# Altium schematic sheet ESenseFE-Dual-TwinT-60HzNotchFilter-AdjQ.SchDoc
size C
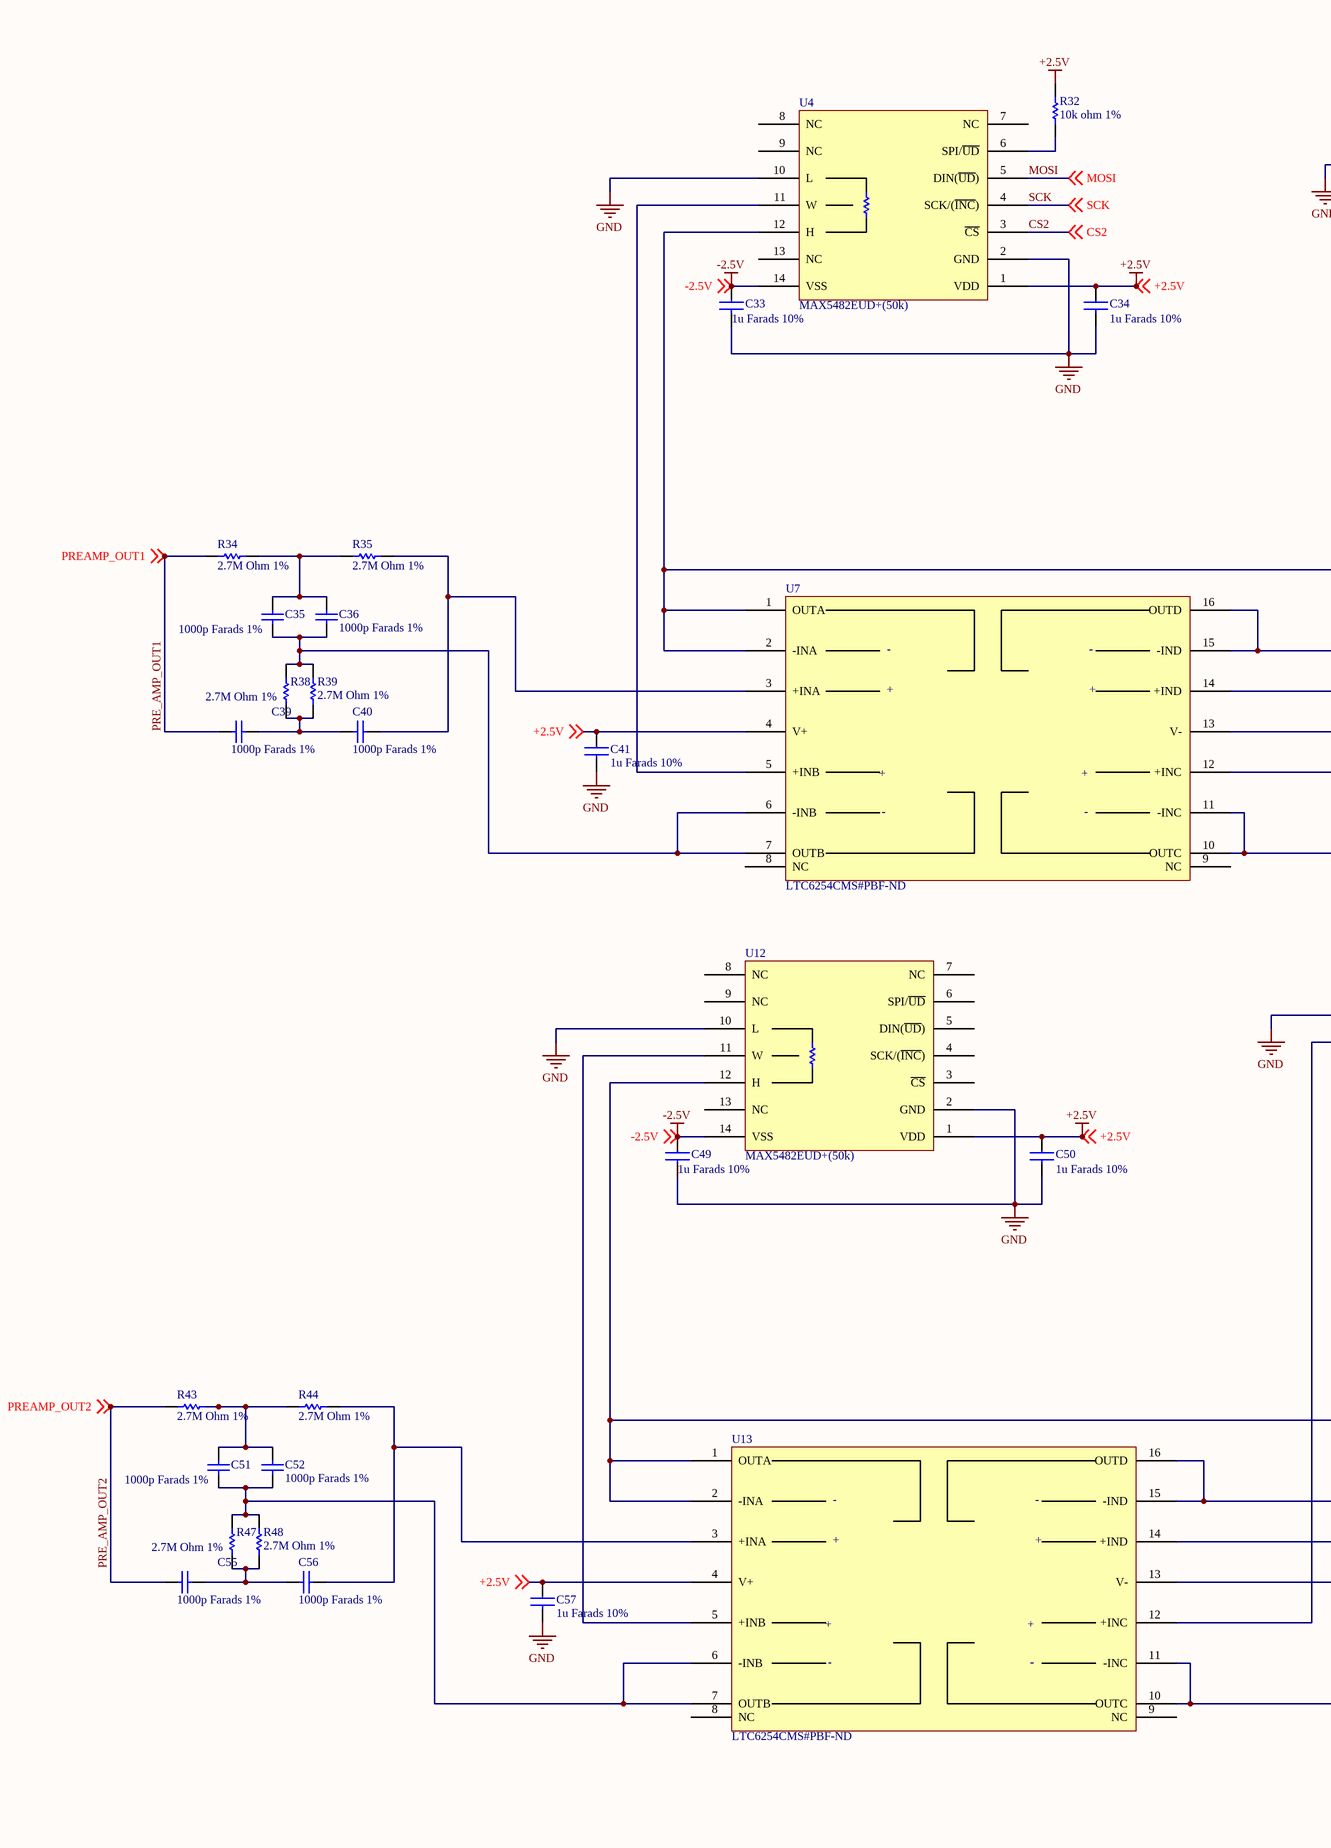
[diagram p0: ESenseFE-Dual-TwinT-60HzNotchFilter-AdjQ.SchDoc, left]
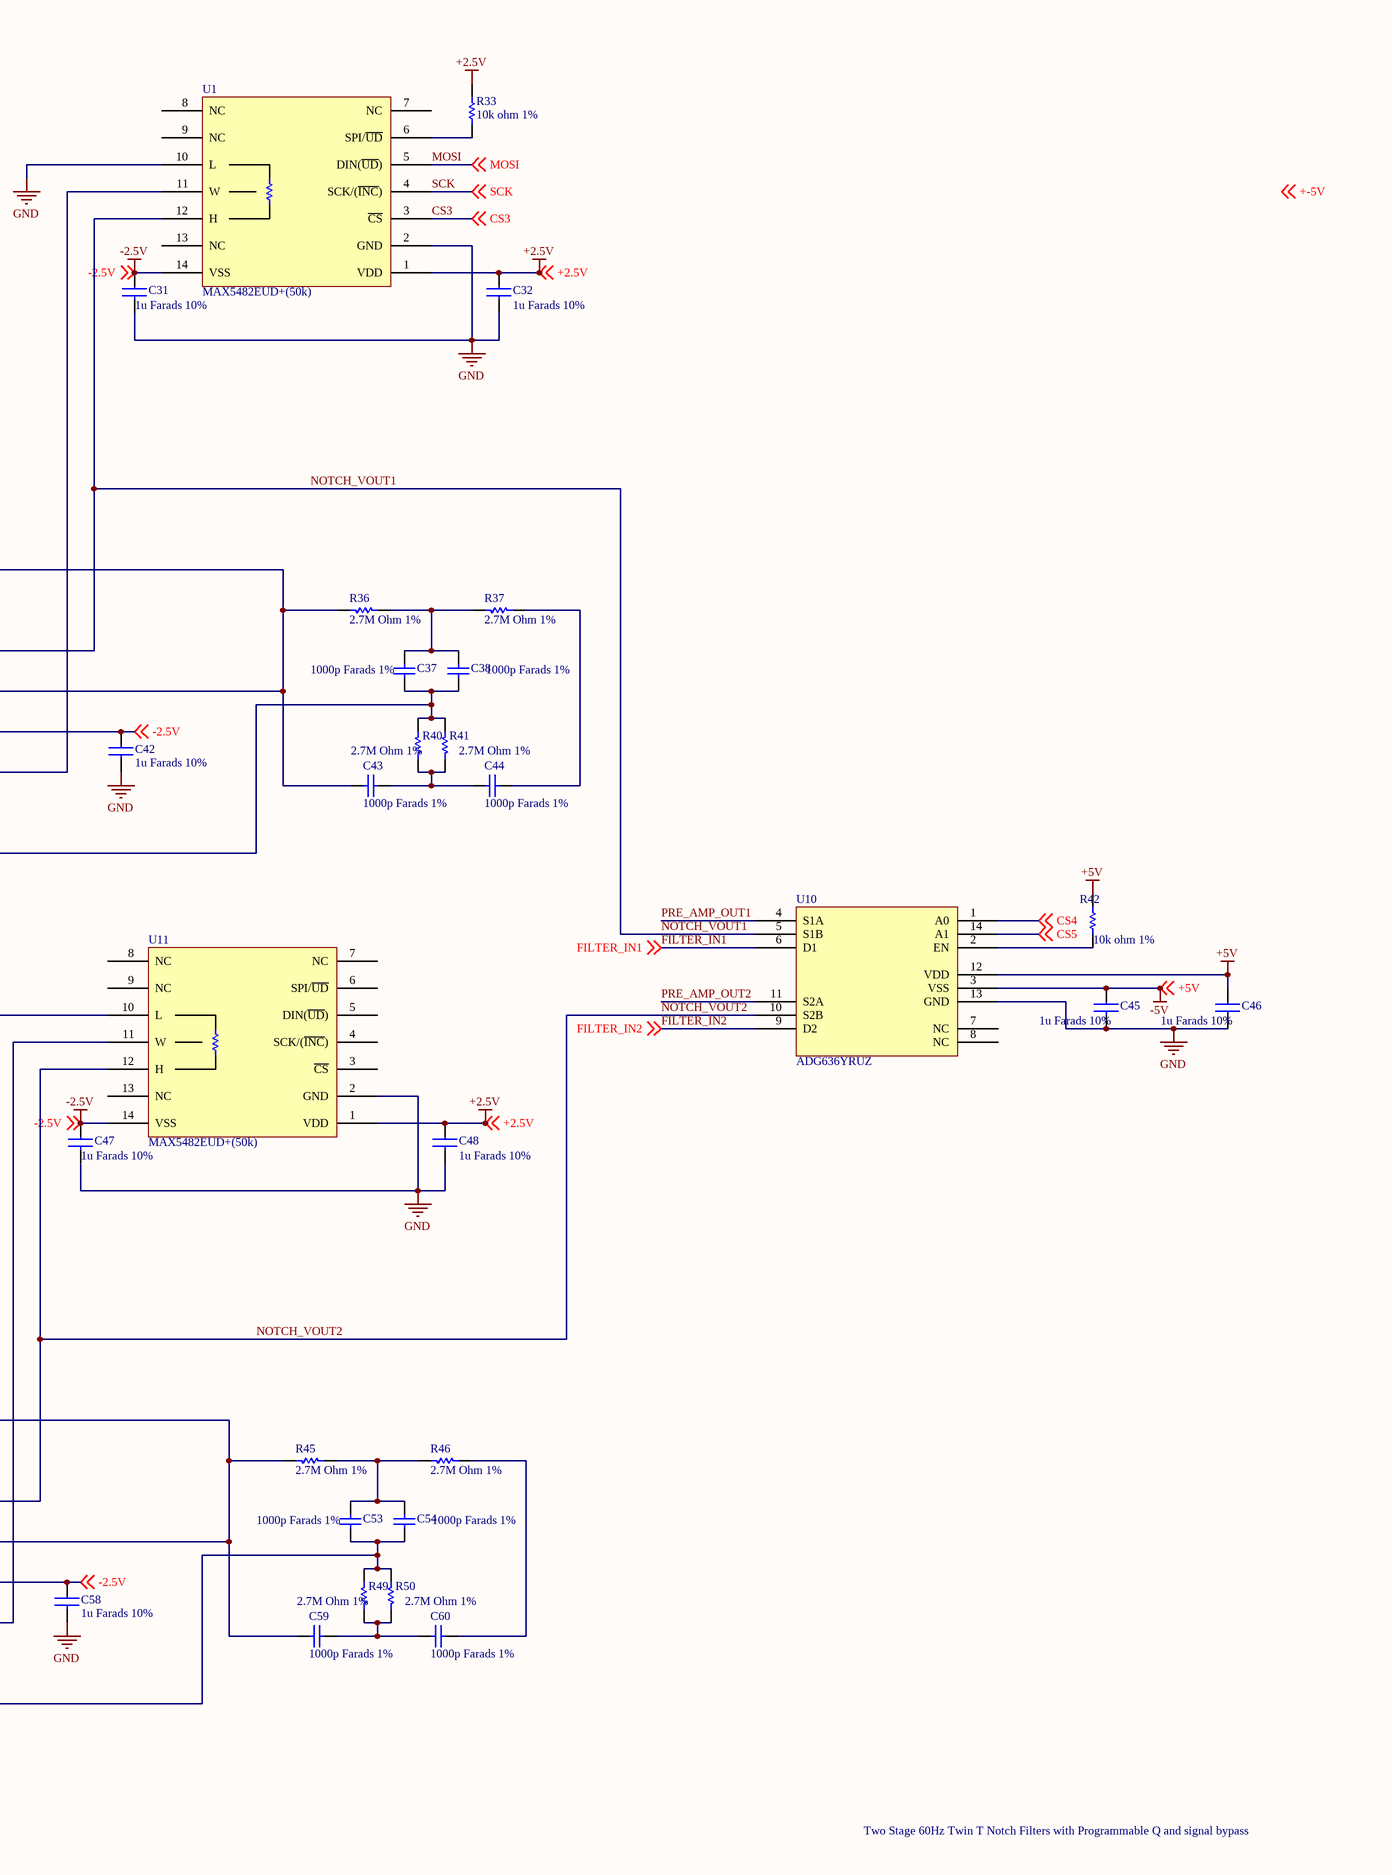
[diagram p1: ESenseFE-Dual-TwinT-60HzNotchFilter-AdjQ.SchDoc, right]

## Parts
C31  1u Farads 10%  [SM/C_0603]
C32  1u Farads 10%  [SM/C_0603]
C33  1u Farads 10%  [SM/C_0603]
C34  1u Farads 10%  [SM/C_0603]
C35  1000p Farads 1%  [SM/C_0603]
C36  1000p Farads 1%  [SM/C_0603]
C37  1000p Farads 1%  [SM/C_0603]
C38  1000p Farads 1%  [SM/C_0603]
C39  1000p Farads 1%  [SM/C_0603]
C40  1000p Farads 1%  [SM/C_0603]
C41  1u Farads 10%  [SM/C_0603]
C42  1u Farads 10%  [SM/C_0603]
C43  1000p Farads 1%  [SM/C_0603]
C44  1000p Farads 1%  [SM/C_0603]
C45  1u Farads 10%  [SM/C_0603]
C46  1u Farads 10%  [SM/C_0603]
C47  1u Farads 10%  [SM/C_0603]
C48  1u Farads 10%  [SM/C_0603]
C49  1u Farads 10%  [SM/C_0603]
C50  1u Farads 10%  [SM/C_0603]
C51  1000p Farads 1%  [SM/C_0603]
C52  1000p Farads 1%  [SM/C_0603]
C53  1000p Farads 1%  [SM/C_0603]
C54  1000p Farads 1%  [SM/C_0603]
C55  1000p Farads 1%  [SM/C_0603]
C56  1000p Farads 1%  [SM/C_0603]
C57  1u Farads 10%  [SM/C_0603]
C58  1u Farads 10%  [SM/C_0603]
C59  1000p Farads 1%  [SM/C_0603]
C60  1000p Farads 1%  [SM/C_0603]
R32  10k ohm 1%  [SM/C_0603]
R33  10k ohm 1%  [SM/C_0603]
R34  2.7M Ohm 1%  [SM/R_0603]
R35  2.7M Ohm 1%  [SM/R_0603]
R36  2.7M Ohm 1%  [SM/R_0603]
R37  2.7M Ohm 1%  [SM/R_0603]
R38  2.7M Ohm 1%  [SM/R_0603]
R39  2.7M Ohm 1%  [SM/R_0603]
R40  2.7M Ohm 1%  [SM/R_0603]
R41  2.7M Ohm 1%  [SM/R_0603]
R42  10k ohm 1%  [SM/C_0603]
R43  2.7M Ohm 1%  [SM/R_0603]
R44  2.7M Ohm 1%  [SM/R_0603]
R45  2.7M Ohm 1%  [SM/R_0603]
R46  2.7M Ohm 1%  [SM/R_0603]
R47  2.7M Ohm 1%  [SM/R_0603]
R48  2.7M Ohm 1%  [SM/R_0603]
R49  2.7M Ohm 1%  [SM/R_0603]
R50  2.7M Ohm 1%  [SM/R_0603]
U1  MAX5482EUD+(50k)  [TSSOP-16Lead-MAX548X]
U4  MAX5482EUD+(50k)  [TSSOP-16Lead-MAX548X]
U7  LTC6254CMS#PBF-ND  [MSOP-16Lead-LTC6254]
U10  ADG636YRUZ  [TSSOP-14Lead-AnalogDevices-ADG636]
U11  MAX5482EUD+(50k)  [TSSOP-16Lead-MAX548X]
U12  MAX5482EUD+(50k)  [TSSOP-16Lead-MAX548X]
U13  LTC6254CMS#PBF-ND  [MSOP-16Lead-LTC6254]

## Nets
+2.5V: C32.1 C34.1 C41.1 C48.1 C50.1 C57.1 R32.2 R33.2 U1.1(VDD) U4.1(VDD) U7.4(V+) U11.1(VDD) U12.1(VDD) U13.4(V+) ; off-sheet +2.5V
+5V: C45.1 C46.1 R42.1 U10.3(VSS) U10.12(VDD) ; off-sheet +5V  [also labelled -5V]
-2.5V: C31.1 C33.1 C42.1 C47.1 C49.1 C58.1 U1.14(VSS) U4.14(VSS) U7.13(V-) U11.14(VSS) U12.14(VSS) U13.13(V-) ; off-sheet -2.5V
GND: C31.2 C32.2 C33.2 C34.2 C41.2 C42.2 C45.2 C46.2 C47.2 C48.2 C49.2 C50.2 C57.2 C58.2 U1.2(GND) U1.10(L) U4.2(GND) U4.10(L) U10.13(GND) U11.2(GND) U11.10(L) U12.2(GND) U12.10(L)
CS2: U4.3(~{CS}) ; off-sheet CS2
CS3: U1.3(~{CS}) ; off-sheet CS3
CS4: U10.1(A0) ; off-sheet CS4
CS5: U10.14(A1) ; off-sheet CS5
FILTER_IN1: U10.6(D1) ; off-sheet FILTER_IN1
FILTER_IN2: U10.9(D2) ; off-sheet FILTER_IN2
MOSI: U1.5(DIN(~{UD})) U4.5(DIN(~{UD})) ; off-sheet MOSI
NOTCH_VOUT1: U1.12(H) U7.15(-IND) U7.16(OUTD) U10.5(S1B)
NOTCH_VOUT2: U10.10(S2B) U11.12(H) U13.15(-IND) U13.16(OUTD)
PRE_AMP_OUT1: C39.2 R34.1 U10.4(S1A) ; off-sheet PREAMP_OUT1  [also labelled PREAMP_OUT1]
PRE_AMP_OUT2: C55.2 R43.1 U10.11(S2A) ; off-sheet PREAMP_OUT2  [also labelled PREAMP_OUT2]
SCK: U1.4(SCK/(~{INC})) U4.4(SCK/(~{INC})) ; off-sheet SCK
NetC35_1: C35.1 C36.1 R38.1 R39.1 U7.6(-INB) U7.7(OUTB)
NetC35_2: C35.2 C36.2 R34.2 R35.1
NetC37_1: C37.1 C38.1 R40.1 R41.1 U7.10(OUTC) U7.11(-INC)
NetC37_2: C37.2 C38.2 R36.1 R37.2
NetC39_1: C39.1 C40.2 R38.2 R39.2
NetC40_1: C40.1 R35.2 U7.3(+INA)
NetC43_1: C43.1 R36.2 U4.12(H) U7.1(OUTA) U7.2(-INA) U7.14(+IND)
NetC43_2: C43.2 C44.1 R40.2 R41.2
NetC44_2: C44.2 R37.1
NetC51_1: C51.1 C52.1 R47.1 R48.1 U13.6(-INB) U13.7(OUTB)
NetC51_2: C51.2 C52.2 R43.2 R44.1
NetC53_1: C53.1 C54.1 R49.1 R50.1 U13.10(OUTC) U13.11(-INC)
NetC53_2: C53.2 C54.2 R45.1 R46.2
NetC55_1: C55.1 C56.2 R47.2 R48.2
NetC56_1: C56.1 R44.2 U13.3(+INA)
NetC59_1: C59.1 R45.2 U12.12(H) U13.1(OUTA) U13.2(-INA) U13.14(+IND)
NetC59_2: C59.2 C60.1 R49.2 R50.2
NetC60_2: C60.2 R46.1
NetR32_1: R32.1 U4.6(SPI/~{UD})
NetR33_1: R33.1 U1.6(SPI/~{UD})
NetR42_2: R42.2 U10.2(EN)
NetU1_11: U1.11(W) U7.12(+INC)
NetU4_11: U4.11(W) U7.5(+INB)
NetU11_11: U11.11(W) U13.12(+INC)
NetU12_11: U12.11(W) U13.5(+INB)

Not connected (* = marked no-connect by the designer): U1 7(NC) 8(NC) 9(NC) 13(NC); U4 7(NC) 8(NC) 9(NC) 13(NC); U7 8(NC) 9(NC); U10 7(NC) 8(NC); U11 3(~{CS}) 4(SCK/(~{INC})) 5(DIN(~{UD})) 6(SPI/~{UD}) 7(NC) 8(NC) 9(NC) 13(NC); U12 3(~{CS}) 4(SCK/(~{INC})) 5(DIN(~{UD})) 6(SPI/~{UD}) 7(NC) 8(NC) 9(NC) 13(NC); U13 8(NC) 9(NC)

## Notes on the sheet
- Two Stage 60Hz Twin T Notch Filters with Programmable Q and signal bypass
- Labels drawn without touching a wire or pin: +-5V
- (in symbol 2191) -; +

## Library data of the parts
C31-C34 C41 C42 C45-C50 C57 C58 = 2065: CAP CER 1.0UF 10V 10% X5R 0603; mfrName: Murata Electronics North America; mfrPartNum: GRM188R61A105KA61D; Extra_Description: Datasheets	Chip Monolithic Ceramic Caps Part Numbering / GRM Series Spec/Test Methods (1) / GRM188R61A105KA61 / Product Photos	0603 Murata MLCC Caps / Product Training Modules	High-Cap Multilayer Ceramic Capacitors / Catalog Drawings	GRM Series Top, Sides / Standard Package	10 / Category	Capacitors / Family	Ceramic / Series	GRM / Capacitance	1.0µF / Voltage - Rated	10V / Tolerance	±10% / Temperature Coefficient	X5R / Mounting Type	Surface Mount, MLCC / Operating Temperature	-55°C ~ 85°C / Features	- / Applications	General Purpose / Ratings	- / Package / Case	0603 (1608 Metric) / Size / Dimension	0.063`` L x 0.032`` W (1.60mm x 0.80mm) / Lead Spacing	- / Thickness	0.80mm / Packaging	Cut Tape (CT) / Lead Style	- / Catalog Page	1886 (US2010 Interactive) / 1886 (US2010 PDF) / Other Names	490-1543-1; Obsolete: False; Temp_Max: 0; Type: Ceramic; PartID: 2065; URL_Image: HTTP://MEDIA.DIGIKEY.COM/PHOTOS/MURATA%20PHOTOS/0603%20MURATA%20MLCC%20CAPS.JPG; URL_Datasheet: http://search.murata.co.jp/Ceramy/image/img/w_hinm/L0005E.pdf; Date_Created: 9/27/2010 4:47:48 PM; Date_LastModified: 9/27/2010 4:47:48 PM; Verified: False; RoHS: True; Temp_Min: 0
C35-C40 C43 C44 C51-C56 C59 C60 = 2205: capacitor ceramic 1000pf, 50v, c0g, 0603; dielectric; mfrName: AVX; mfrPartNum: 06035A102FAT2A; Label: 1uF; Extra_Description: CAPACITOR CERAMIC 1000PF, 50V, C0G, 0603; Dielectric Characteristic:C0G/NP0; Capacitance:1000pF; Capacitance Tolerance:± 1%; Voltage Rating:50V; Temperature Coefficient:0 ± 30ppm/°C; Capacitor Case Style:0603; No. of Pins:2 ;RoHS Compliant: Yes / Packaging: ``Tape`` / RoHS: ``Compliant`` / Voltage Rating (DC): { / ``uncertainty_minus``: null, / ``value``: 50.0, / ``uncertainty_plus``: null / } / Capacitance: { / ``uncertainty_minus``: null, / ``value``: 1E-09, / ``uncertainty_plus``: null / } / Capacitance Tolerance: { / ``max_value``: 1.0, / ``max_uncertainty_plus``: null, / ``min_value``: -1.0, / ``min_uncertainty_plus``: null, / ``max_uncertainty_minus``: null / } / Number of Pins: 2; Obsolete: False; Temp_Max: 0; Type: All Parts; TypeNotes: Applies to all parts in the database; PartID: 2205; URL_Image: http://cdn.sigma.octopart.com/8893021/image/AVX-06035A102FAT2A.jpg; URL_Datasheet: http://datasheet.octopart.com/06035A102FAT2A-AVX-datasheet-8446347.pdf; Date_Created: 5/8/2011 9:06:39 AM; Date_LastModified: 5/8/2011 9:06:39 AM; Verified: False; RoHS: True; Temp_Min: 0
R32 R33 R42 = 2165: resistor, 0603, 0.1w, 1%, 10k; resistance:10kohm; resistance; mfrName: Panasonic; mfrPartNum: ERJ-3EKF1002V; Value: 1K; Extra_Description: RESISTOR, 0603, 0.1W, 1%, 10K; Resistance:10kohm; Resistance Tolerance:± 1%; Power Rating:0.1W; Voltage Rating:75V; Series:ERJ; Temperature Coefficient:± 200ppm/°C; Resistor Element Type:Thick Film; Resistor Case Style:0603; No. of Pins:2; Case Style:0603; External Length / Height:0.45mm; External Depth:0.8mm; External Width:1.6mm; Operating Temperature Range:-55°C to +155°C; Overload Voltage:150V; Reel Quantity:5000; Termination Type:SMD / Mounting Type: ``Surface Mount`` / Case / Package: ``0603`` / Packaging: ``Cut Tape (CT)`` / Lead-Free Status: ``Contains Lead`` / RoHS: ``Compliant`` / Resistance: { / ``uncertainty_minus``: null, / ``value``: 10000.0, / ``uncertainty_plus``: null / } / Voltage Rating (DC): { / ``uncertainty_minus``: null, / ``value``: 75.0, / ``uncertainty_plus``: null / } / Size-Width: { / ``uncertainty_minus``: null, / ``value``: 0.0008, / ``uncertainty_plus``: null / } / Size-Length: { / ``uncertainty_minus``: null, / ``value``: 0.0016, / ``uncertainty_plus``: null / } / Size-Height: { / ``uncertainty_minus``: null, / ``value``: 0.00045, / ``uncertainty_plus``: null / } / Power Rating: { / ``uncertainty_minus``: null, / ``value``: 0.1, / ``uncertainty_plus``: null / } / Resistance Tolerance: { / ``max_value``: 1.0, / ``max_uncertainty_plus``: null, / ``min_value``: -1.0, / ``min_uncertainty_plus``: null, / ``max_uncertainty_minus``: null / } / Operating Temperature: { / ``max_value``: 125.0, / ``max_uncertainty_plus``: null, / ``min_value``: null, / ``min_uncertainty_plus``: null, / ``max_uncertainty_minus``: null / } / Number of Pins: 2; Obsolete: False; Temp_Max: 0; TypeNotes: Applies to all parts in the database; Published: 8-Jun-2000; LatestRevisionDate: 17-Jul-2002; LatestRevisionNote: Re-released for DXP Platform.; PackageReference: AXIAL-0.3; Publisher: Altium Limited; PartID: 2165; URL_Image: http://cdn.sigma.octopart.com/8893006/image/Panasonic-ERJ-3EKF1002V.jpg; URL_Datasheet: http://datasheet.octopart.com/ERJ-3EKF1002V-Panasonic-datasheet-118621.pdf; Date_Created: 4/24/2011 7:23:38 AM; Date_LastModified: 4/24/2011 7:23:38 AM; Verified: False; RoHS: True; Temp_Min: 0; Type: All Parts
R34-R41 R43-R50 = 2206: res, thick film, 2.7mohm, 100mw, 1%; resistance:2.7mohm;; mfrName: Vishay; mfrPartNum: CRCW06032M70FKEA; Value: 1K; Extra_Description: RES, THICK FILM, 2.7MOHM, 100mW, 1%; Resistance:2.7Mohm; Resistance Tolerance:± 1%; Power Rating:100mW; Series:CRCW; Temperature Coefficient:± 100ppm; Resistor Element Material:Thick Film; Resistor Case Style:0603; No. of Pins:2 ;RoHS Compliant: Yes / Mounting Type: ``Surface Mount`` / Case / Package: ``0603`` / Packaging: ``Cut Tape (CT)`` / Lead-Free Status: ``Lead Free`` / RoHS: ``Compliant`` / Power Rating: { / ``uncertainty_minus``: null, / ``value``: 0.1, / ``uncertainty_plus``: null / } / Resistance: { / ``uncertainty_minus``: null, / ``value``: 2700000.0, / ``uncertainty_plus``: null / } / Size-Height: { / ``uncertainty_minus``: null, / ``value``: 0.00045, / ``uncertainty_plus``: null / } / Size-Length: { / ``uncertainty_minus``: null, / ``value``: 0.00155, / ``uncertainty_plus``: null / } / Size-Width: { / ``uncertainty_minus``: null, / ``value``: 0.00085, / ``uncertainty_plus``: null / } / Resistance Tolerance: { / ``max_value``: 1.0, / ``max_uncertainty_plus``: null, / ``min_value``: -1.0, / ``min_uncertainty_plus``: null, / ``max_uncertainty_minus``: null / } / Operating Temperature: { / ``max_value``: 150.0, / ``max_uncertainty_plus``: null, / ``min_value``: null, / ``min_uncertainty_plus``: null, / ``max_uncertainty_minus``: null / }; Obsolete: False; Temp_Max: 0; TypeNotes: Applies to all parts in the database; Published: 8-Jun-2000; LatestRevisionDate: 17-Jul-2002; LatestRevisionNote: Re-released for DXP Platform.; PackageReference: AXIAL-0.3; Publisher: Altium Limited; PartID: 2206; URL_Image: http://cdn.sigma.octopart.com/8893816/image/Vishay-CRCW06032M70FKEA.jpg; URL_Datasheet: http://datasheet.octopart.com/CRCW06032M70FKEA-Vishay-datasheet-8445837.pdf; Date_Created: 5/8/2011 9:12:23 AM; Date_LastModified: 5/8/2011 9:12:23 AM; Verified: False; RoHS: True; Temp_Min: 0; Type: All Parts
U1 U4 U11 U12 = 2194: dpot, nv, linear taper, 10 bit, smd; resistance range; mfrName: MAXIM; mfrPartNum: MAX5482EUD+(1); Extra_Description: DPOT, NV, LINEAR TAPER, 10 BIT, SMD; Resistance Range Type:Linear; Memory Type:Non-Volatile; No. of Channels:1; No. of Positions:1024; Resistance, End-to-End:10kohm; Interface Type:SPI, Serial, 3 Wire; Voltage, Supply Min:2.7V; Voltage, Supply Max:5.25V; Termination Type:SMD; Case Style:TSSOP; No. of Pins:14; Operating Temperature Range:-40°C to +85°C; Temp, Op. Max:85°C; Temp, Op. Min:-40°C; Base Number:5483; Supply Voltage:2.7V; Track Resistance:10kohm / RoHS: ``Compliant`` / Supply Voltage (DC): { / ``uncertainty_minus``: null, / ``value``: 2.7, / ``uncertainty_plus``: null / } / Resistance Tolerance: { / ``max_value``: 25.0, / ``max_uncertainty_plus``: null, / ``min_value``: -25.0, / ``min_uncertainty_plus``: null, / ``max_uncertainty_minus``: null / } / Number of Pins: 14; Obsolete: False; Temp_Max: 0; TypeNotes: Applies to all parts in the database; PartID: 2194; URL_Image: http://cdn.sigma.octopart.com/8907955/image/Maxim-MAX5483EUD%2B.jpg; URL_Datasheet: http://datasheet.octopart.com/MAX5483EUD%2B-Maxim-datasheet-529274.pdf; Date_Created: 5/5/2011 10:56:31 AM; Date_LastModified: 5/5/2011 10:56:31 AM; Verified: False; RoHS: True; Temp_Min: 0; Type: All Parts
U7 U13 = 2191: op amp, dual, r-r, 180mhz, 8msop; op amp type:unity gain; mfrName: Linear Technology; Extra_Description: OP AMP, DUAL, R-R, 180MHZ, 8MSOP; Op Amp Type:Unity Gain Stable; No. of Amplifiers:2; Bandwidth:180MHz; Slew Rate:90V/µs; Supply Voltage Range:2.5V to 5.25V; Amplifier Case Style:MSOP; No. of Pins:8; SVHC:No SVHC (15-Dec-2010); Base Number:6247; Operating Temperature Range:0°C to +70°C / RoHS: ``Compliant`` / Slew Rate: { / ``uncertainty_minus``: null, / ``value``: 90.0, / ``uncertainty_plus``: null / } / Number of Pins: 8; Obsolete: False; Temp_Max: 0; TypeNotes: Applies to all parts in the database; PartID: 2191; mfrPartNum: LTC6254CMS#PBF-ND; URL_Image: http://cds.linear.com/images/product/4358_pack_3.jpg; URL_Datasheet: http://datasheet.octopart.com/LTC6247CMS8%23PBF-Linear-Technology-datasheet-8712476.pdf; Date_Created: 5/5/2011 9:52:24 AM; Date_LastModified: 5/5/2011 9:52:24 AM; Verified: False; RoHS: True; Temp_Min: 0; Type: All Parts
U10 = 2209: switch, spdt dual, tssop14, 636; switch type, analogue:spdt;; mfrName: Analog Devices; Extra_Description: SWITCH, SPDT DUAL, TSSOP14, 636; Switch Type, Analogue:SPDT; Switches, No. of:2; Voltage, Supply Source:Dual; Resistance, On State:85ohm; Voltage, Supply Min:2.7V; Voltage, Supply Max:5.5V; Termination Type:SMD; Case Style:TSSOP; No. of Pins:14; Operating Temperature Range:-40°C to +125°C; Base Number:636 / Mounting Type: ``Surface Mount`` / Case / Package: ``TSSOP-14`` / Packaging: ``Bulk`` / Lead-Free Status: ``Lead Free`` / RoHS: ``Compliant`` / Rds [Drain to Source Resistance] (on): { / ``uncertainty_minus``: null, / ``value``: 85.0, / ``uncertainty_plus``: null / } / Supply Voltage (DC): { / ``max_value``: 5.5, / ``max_uncertainty_plus``: null, / ``min_value``: null, / ``min_uncertainty_plus``: null, / ``max_uncertainty_minus``: null / } / Number of Channels: 2 / Number of Pins: 14; Obsolete: False; Temp_Max: 0; TypeNotes: Applies to all parts in the database; PartID: 2209; mfrPartNum: ADG636YRUZ; URL_Image: http://cdn.sigma.octopart.com/8900696/image/Analog-Devices-ADG636YRUZ.jpg; URL_Datasheet: http://datasheet.octopart.com/ADG636YRUZ-Analog-Devices-datasheet-11285.pdf; Date_Created: 5/8/2011 10:47:40 AM; Date_LastModified: 5/8/2011 10:47:40 AM; Verified: False; RoHS: True; Temp_Min: 0; Type: All Parts